# Altium schematic sheet top.SchDoc
size A4
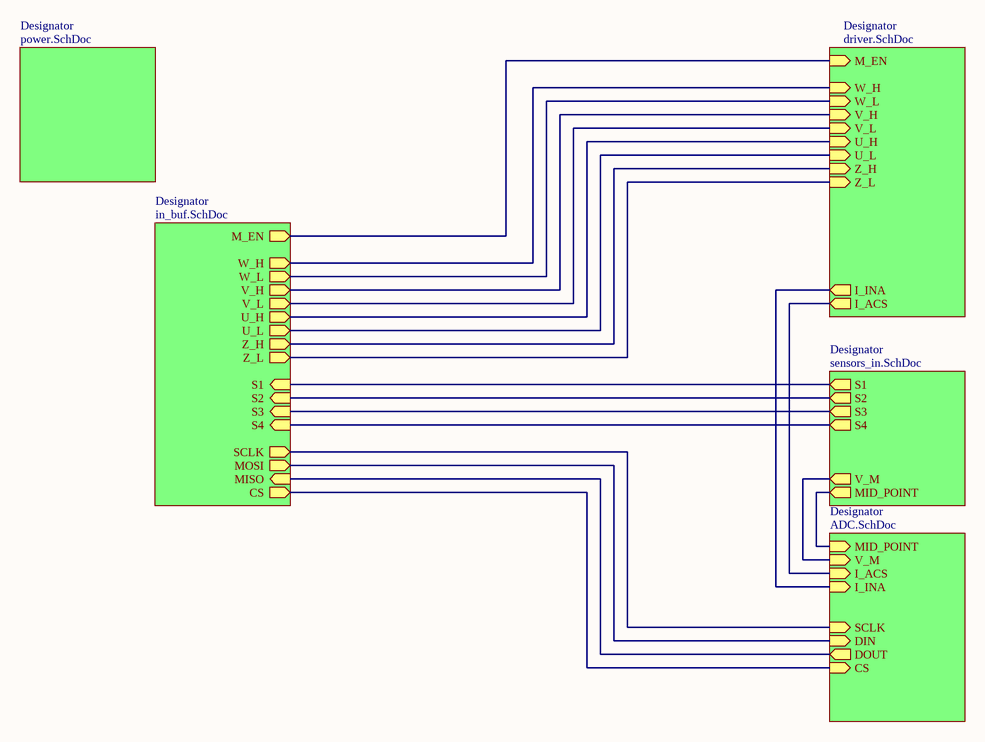
[diagram p0: top.SchDoc]

## Sub-sheets
Designator = power.SchDoc: no entries
Designator = driver.SchDoc: Z_L (in), Z_H (in), U_L (in), V_L (in), U_H (in), I_INA (out), M_EN (in), W_H (in), W_L (in), V_H (in), I_ACS (out)
Designator = ADC.SchDoc: I_ACS (in), SCLK (in), MID_POINT (in), CS (in), I_INA (in), V_M (in), DIN (in), DOUT (out)
Designator = in_buf.SchDoc: U_L (out), MOSI (out), Z_H (out), S1 (in), M_EN (out), V_H (out), S4 (in), SCLK (out), Z_L (out), CS (out), MISO (in), W_L (out), S2 (in), S3 (in), V_L (out), U_H (out), W_H (out)
Designator = sensors_in.SchDoc: S1 (out), S4 (out), V_M (out), MID_POINT (out), S2 (out), S3 (out)

## Nets
(unnamed): sheet Designator/Z_L, sheet Designator/Z_L
(unnamed): sheet Designator/Z_H, sheet Designator/Z_H
(unnamed): sheet Designator/U_L, sheet Designator/U_L
(unnamed): sheet Designator/V_L, sheet Designator/V_L
(unnamed): sheet Designator/U_H, sheet Designator/U_H
(unnamed): sheet Designator/I_INA, sheet Designator/I_INA
(unnamed): sheet Designator/M_EN, sheet Designator/M_EN
(unnamed): sheet Designator/W_H, sheet Designator/W_H
(unnamed): sheet Designator/W_L, sheet Designator/W_L
(unnamed): sheet Designator/V_H, sheet Designator/V_H
(unnamed): sheet Designator/I_ACS, sheet Designator/I_ACS
(unnamed): sheet Designator/SCLK, sheet Designator/SCLK
(unnamed): sheet Designator/MID_POINT, sheet Designator/MID_POINT
(unnamed): sheet Designator/CS, sheet Designator/CS
(unnamed): sheet Designator/V_M, sheet Designator/V_M
(unnamed): sheet Designator/DIN, sheet Designator/MOSI
(unnamed): sheet Designator/DOUT, sheet Designator/MISO
(unnamed): sheet Designator/S1, sheet Designator/S1
(unnamed): sheet Designator/S4, sheet Designator/S4
(unnamed): sheet Designator/S2, sheet Designator/S2
(unnamed): sheet Designator/S3, sheet Designator/S3